# EAGLE schematic QuadCopter_Controller (EAGLE 7.7.0)
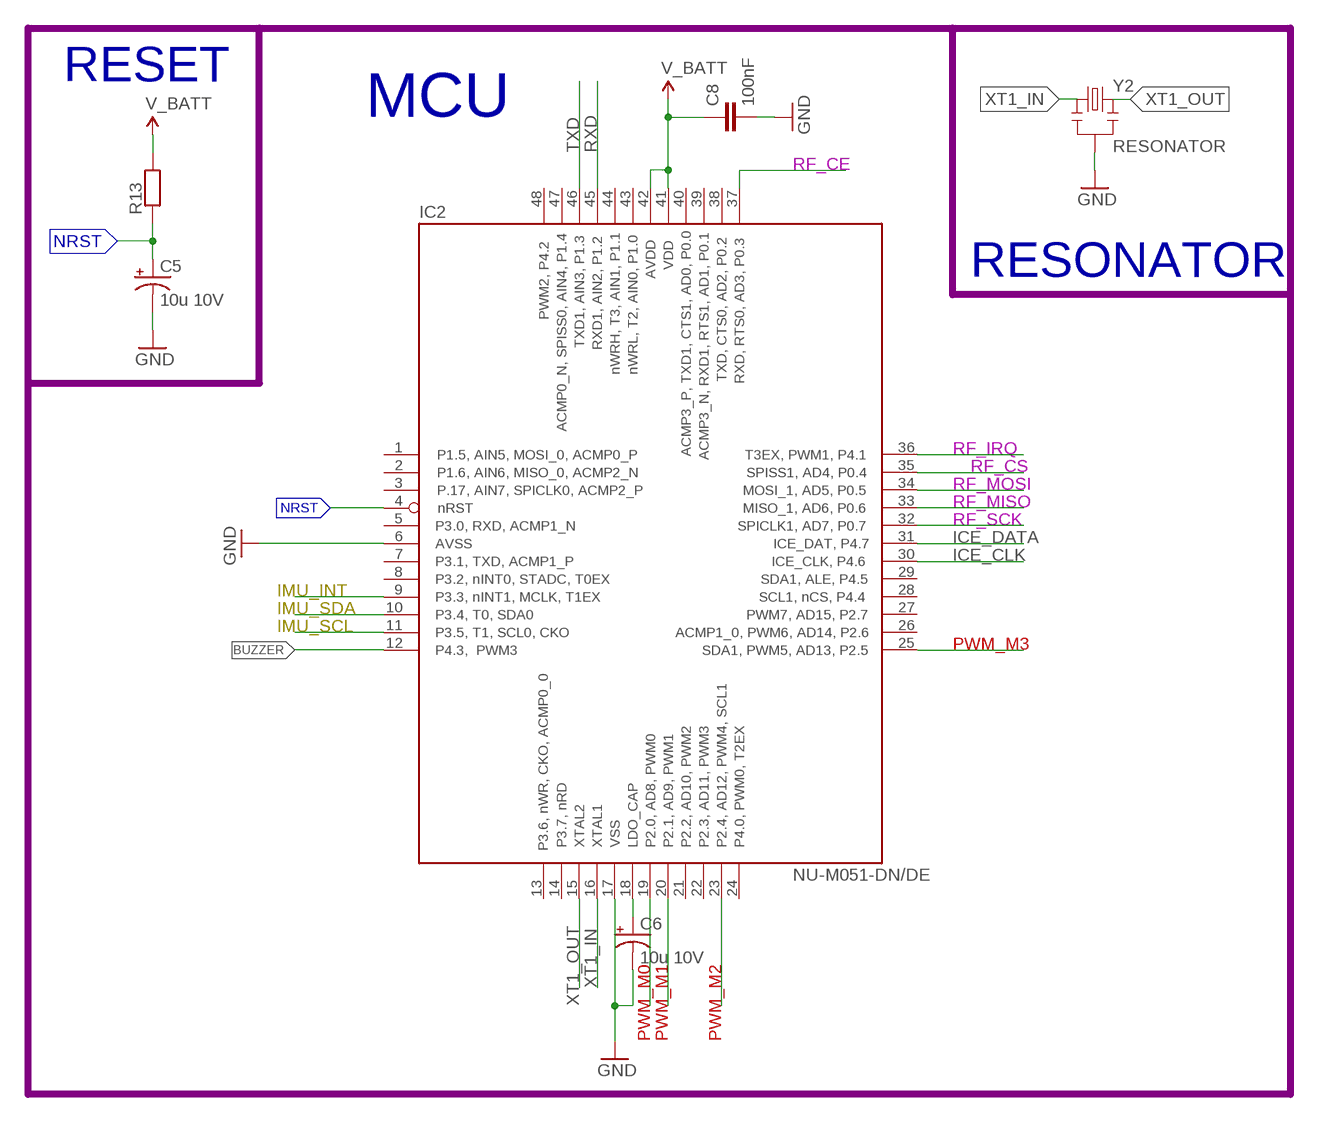
[diagram p0: schematic, sheet 1, part 1 of 2]
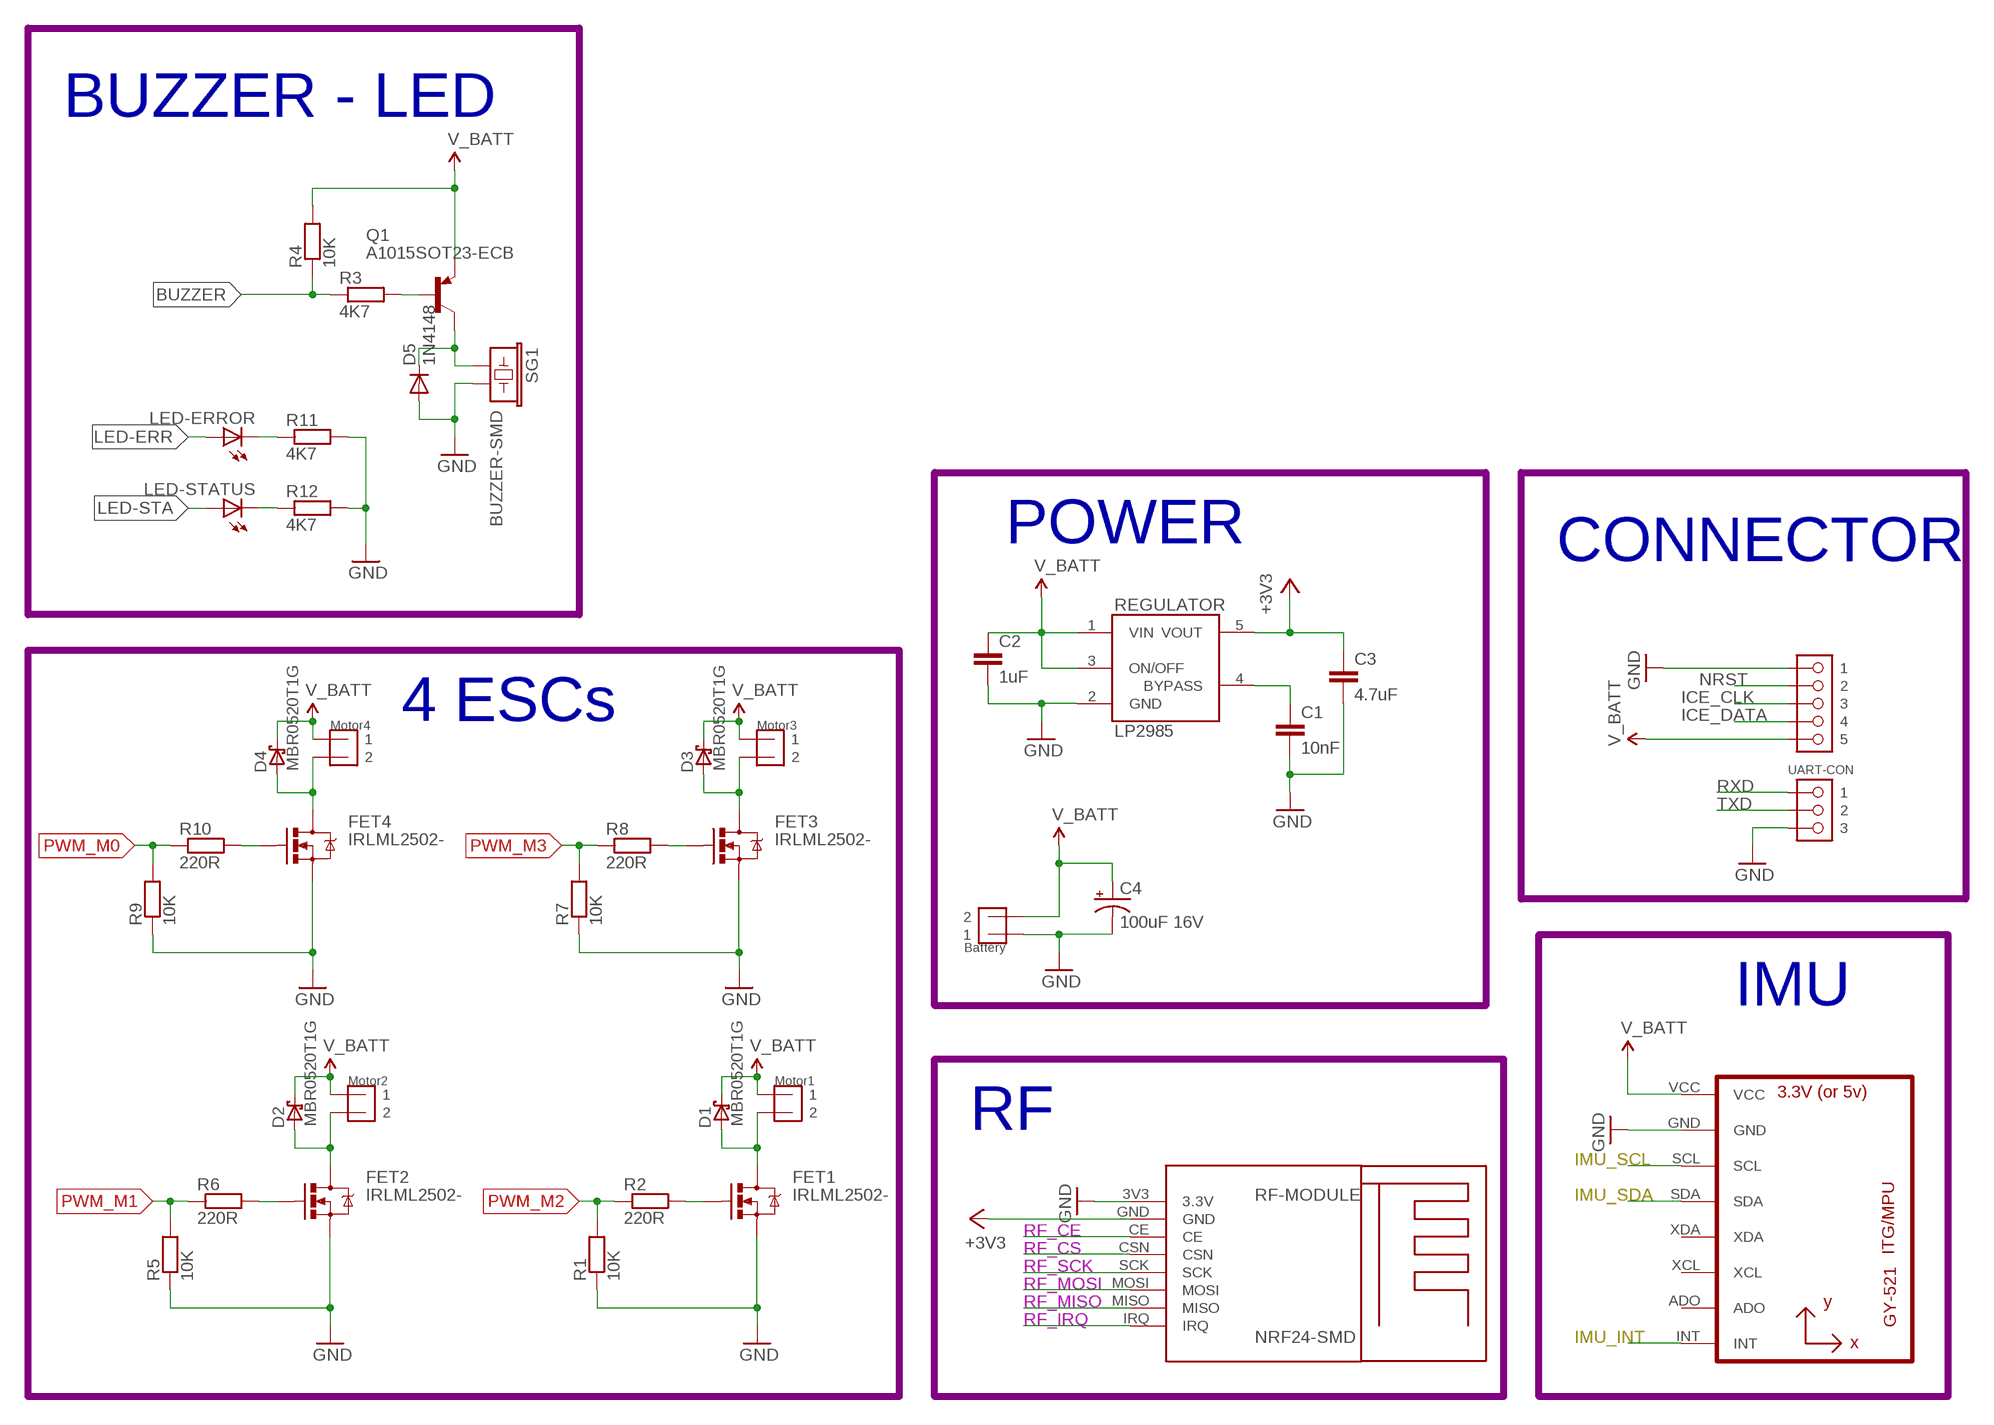
[diagram p1: schematic, sheet 1, part 2 of 2]

## Parts
BATTERY  Battery  WAFER-CON-2P  [WAFER-CON-2P]
C1  10nF  C-SMDC0603K  [C0603K]
C2  1uF  C-SMDC0603K  [C0603K]
C3  4.7uF  C-SMDC0603K  [C0603K]
C4  100uF 16V  C-ALU-D  [PANASONIC_D]
C5  10u 10V  CAP_POL1206  [EIA3216]
C6  10u 10V  CAP_POL1206  [EIA3216]
C8  100nF  C-SMDC0603K  [C0603K]
D1  MBR0520T1G  D-SCKYMBR0520T1G  [SOD123]
D2  MBR0520T1G  D-SCKYMBR0520T1G  [SOD123]
D3  MBR0520T1G  D-SCKYMBR0520T1G  [SOD123]
D4  MBR0520T1G  D-SCKYMBR0520T1G  [SOD123]
D5  1N4148  1N4148-SOD123  [SOD123]
FET1  IRLML2502-  [SOT-23]
FET2  IRLML2502-  [SOT-23]
FET3  IRLML2502-  [SOT-23]
FET4  IRLML2502-  [SOT-23]
IC2  NU-M051-DN/DE  [LQFP48]
LED-ERROR  LED0805  [LED_0805]
LED-STATUS  LED0805  [LED_0805]
MOTOR1  Motor1  WAFER-CON-2P  [WAFER-CON-2P]
MOTOR2  Motor2  WAFER-CON-2P  [WAFER-CON-2P]
MOTOR3  Motor3  WAFER-CON-2P  [WAFER-CON-2P]
MOTOR4  Motor4  WAFER-CON-2P  [WAFER-CON-2P]
Q1  A1015SOT23-ECB  [SOT23-ECB]
R1  10K  RESISTOR-SMDR0603  [R0603]
R2  220R  RESISTOR-SMDR0603  [R0603]
R3  4K7  RESISTOR-SMDR0805  [R0805]
R4  10K  RESISTOR-SMDR0805  [R0805]
R5  10K  RESISTOR-SMDR0603  [R0603]
R6  220R  RESISTOR-SMDR0603  [R0603]
R7  10K  RESISTOR-SMDR0603  [R0603]
R8  220R  RESISTOR-SMDR0603  [R0603]
R9  10K  RESISTOR-SMDR0603  [R0603]
R10  220R  RESISTOR-SMDR0603  [R0603]
R11  4K7  RESISTOR-SMDR0805  [R0805]
R12  4K7  RESISTOR-SMDR0805  [R0805]
R13  RESISTOR-SMDR0603  [R0603]
REGULATOR  Regulator  LP2985AIM5-3.3  [SOT25]
RF-MODULE  NRF24-SMD  [NRF24-SMD]
SG1  BUZZER-SMD  BUZZERSMD2-KIT  [BUZZER-CCV-KIT]
U1  GY-521MPU6050  [GY-521]
U$1  ICE_CON  WAFER-CON-5P  [WAFER-CON-5P]
U$2  UART-CON  WAFER-CON-3P  [WAFER-CON-3P]
Y2  RESONATOR  RESONATOR-ARDUINO-PRO-MINISMD  [RESONATOR-SMD]

## Nets
+3V3: C3.1 REGULATOR.5(VOUT) RF-MODULE.GND
BUZZER: IC2.12 R3.1 R4.1
BYPASS: C1.1 REGULATOR.4(BYPASS)
GND: BATTERY.P$1 C1.2 C2.2 C3.2 C4.- C5.C(-) C6.C(-) C8.2 D5.A FET1.2(S) FET2.2(S) FET3.2(S) FET4.2(S) IC2.6 IC2.17 R1.1 R5.1 R7.1 R9.1 R11.2 R12.2 REGULATOR.2(GND) RF-MODULE.3V3(3.3V) SG1.- U1.GND U$1.P$1 U$2.P$3 Y2.2
ICE_CLK: IC2.30 U$1.P$3
ICE_DATA: IC2.31 U$1.P$4
IMU_INT: IC2.9 U1.INT
IMU_SCL: IC2.11 U1.SCL
IMU_SDA: IC2.10 U1.SDA
LED-ERR: LED-ERROR.A
LED-STA: LED-STATUS.A
N$1: FET1.1(G) R2.2
N$2: D5.C Q1.C SG1.+
N$3: D1.A FET1.3(D) MOTOR1.P$2
N$4: FET2.1(G) R6.2
N$5: D2.A FET2.3(D) MOTOR2.P$2
N$6: FET3.1(G) R8.2
N$7: D3.A FET3.3(D) MOTOR3.P$2
N$8: Q1.B R3.2
N$9: FET4.1(G) R10.2
N$10: D4.A FET4.3(D) MOTOR4.P$2
N$12: LED-STATUS.C R12.1
N$13: LED-ERROR.C R11.1
N$14: C6.A(+) IC2.18
NRST: C5.A(+) IC2.4 R13.1 U$1.P$2
PWM_M0: IC2.19 R9.2 R10.1
PWM_M1: IC2.20 R5.2 R6.1
PWM_M2: IC2.23 R1.2 R2.1
PWM_M3: IC2.25 R7.2 R8.1
RF_CE: IC2.37 RF-MODULE.CE
RF_CS: IC2.35 RF-MODULE.CSN
RF_IRQ: IC2.36 RF-MODULE.IRQ
RF_MISO: IC2.33 RF-MODULE.MISO
RF_MOSI: IC2.34 RF-MODULE.MOSI
RF_SCK: IC2.32 RF-MODULE.SCK
RXD: IC2.45 U$2.P$1
TXD: IC2.46 U$2.P$2
V_BATT: BATTERY.P$2 C2.1 C4.+ C8.1 D1.C D2.C D3.C D4.C IC2.41 IC2.42 MOTOR1.P$1 MOTOR2.P$1 MOTOR3.P$1 MOTOR4.P$1 Q1.E R4.2 R13.2 REGULATOR.1(VIN) REGULATOR.3(ON/OFF) U1.VCC U$1.P$5
XT1_IN: IC2.16 Y2.1
XT1_OUT: IC2.15 Y2.3
Unconnected: IC2.1 IC2.2 IC2.3 IC2.5 IC2.7 IC2.8 IC2.13 IC2.14 IC2.21 IC2.22 IC2.24 IC2.26 IC2.27 IC2.28 IC2.29 IC2.38 IC2.39 IC2.40 IC2.43 IC2.44 IC2.47 IC2.48 U1.ADO U1.XCL U1.XDA

## Notes on the sheet
- BUZZER - LED
- RESET
- MCU
- POWER | CONNECTOR
- RESONATOR
- 4 ESCs
- IMU
- RF

## Library data of the parts
BATTERY MOTOR1-MOTOR4 = Connector:WAFER-CON-2P
C1-C3 C8 = RCL:C-SMD: Capacitor Standard 0603 ceramic capacitor, and 0.1" leaded capacitor. Có đuôi "K" là loại Reflow solder
C4 = RCL:C-ALU: Tụ nhôm dán size A - G Electrolytic Alumium SMT
C5 C6 = Cap-Pol-Smd:CAP_POL: Capacitor Polarized These are standard SMD and PTH capacitors. Normally 10uF, 47uF, and 100uF in electrolytic and tantalum varieties. Always verify the external diameter of the through hole cap, it varies with capacity, voltage, and manufacturer. The EIA devices should be standard.
D1-D4 = Diode:D-SCKY: 1N4148 General Purpose Rectifie SMD-Version of 1N4148 Case: SOD 80 = DO 213 AA = MINIMELF (Glass) Author: Dipl.-Ing. FH Rainer Bayer HHN Hochschule Heilbronn, rainer.bayer@hs-heilbronn.de Ingenieurbüro ing-rb, mail@ing-rb.de
D5 = Diode:1N4148: DIODE high speed (Philips)
FET1-FET4 = FET:IRLML2502: N-Channel MOSFET, Ultra Low On-Resistance, Fast Switching
IC2 = MCU:NU-M051-DN/DE: MICROCONTROLLER 16 Kbytes FLASH 1 Kbytes EEPROM 1 Kbytes SRAM UART 8-channel 10 bit ADC hardware multiplier Source: avr.lbr
LED-ERROR LED-STATUS = LED:LED: LEDs Standard schematic elements and footprints for 5mm, 3mm, 1206, and 0603 sized LEDs. 5mm - Spark Fun Electronics SKU : COM-00529 (and others)
Q1 = Transistor:A1015: PNP Transistror SMD code A1015 : BA
R1-R13 = RCL:RESISTOR-SMD: Resistor Basic schematic elements and footprints for 0603, 0805, 1206, 2010, 2512 resistors.
REGULATOR = Regulator-linear:LP2985: LP2985-N Micropower 150 mA Low-Noise Ultra Low-Dropout Regulator
RF-MODULE = Module:NRF24-SMD: NRF24L01+ SMD version More details available here: http://www.electrodragon.com/product/nrf24-mini-smd-wireless-module-nrf24l01-compatible/
SG1 = DangKiet:BUZZER: Buzzer 12mm Spark Fun Electronics SKU : Comp-Buzzer
U1 = gy-521:GY-521: Details about GY-521 MPU-6050 Module 3 Axis gyro + 3 Axis Accelerometer More details available here: http://hshop.vn/products/cam-bien-6-dof-bac-tu-do-gy-521-mpu6050 http://www.ebay.com/itm/GY-521-MPU-6050-Module-3-Axis-gyro-3-Axis-Accelerometer-Module-For-Arduino-/231214060723
U$1 = Connector:WAFER-CON-5P: pitch 2.5mm
U$2 = Connector:WAFER-CON-3P: pitch 2.5mm
Y2 = Resonator:RESONATOR-ARDUINO-PRO-MINI: Resonator Small SMD resonator. This is the itty bitty 10/20MHz resonators with built in caps. CSTCE10M0G55 and CSTCE20M0V53. Footprint for SMD has been used in SFE production for years, and does work okay. 1:1 is an attempt to get larger fillets on the sides so it will be easier to inspect these solders in our AOI machine. The pads have been minimized to match the actual metal under the resonator. To see this relation, it includes an image import of the bottom side of the component. Imported to scale on layer 200.